# EasyEDA Pro project ProPrj_elrsTransmitter_2026-04-23.epro

# Schematic Schematic2
Board Name: PCB2; Create Date: 2026-03-08; Page Name: P1; Project Name: elrsTransmitter; Schematic Name: Schematic2; Update Date: 2026-03-09; Company: EasyEDA.com; Page Size: A4; Version: V1.0
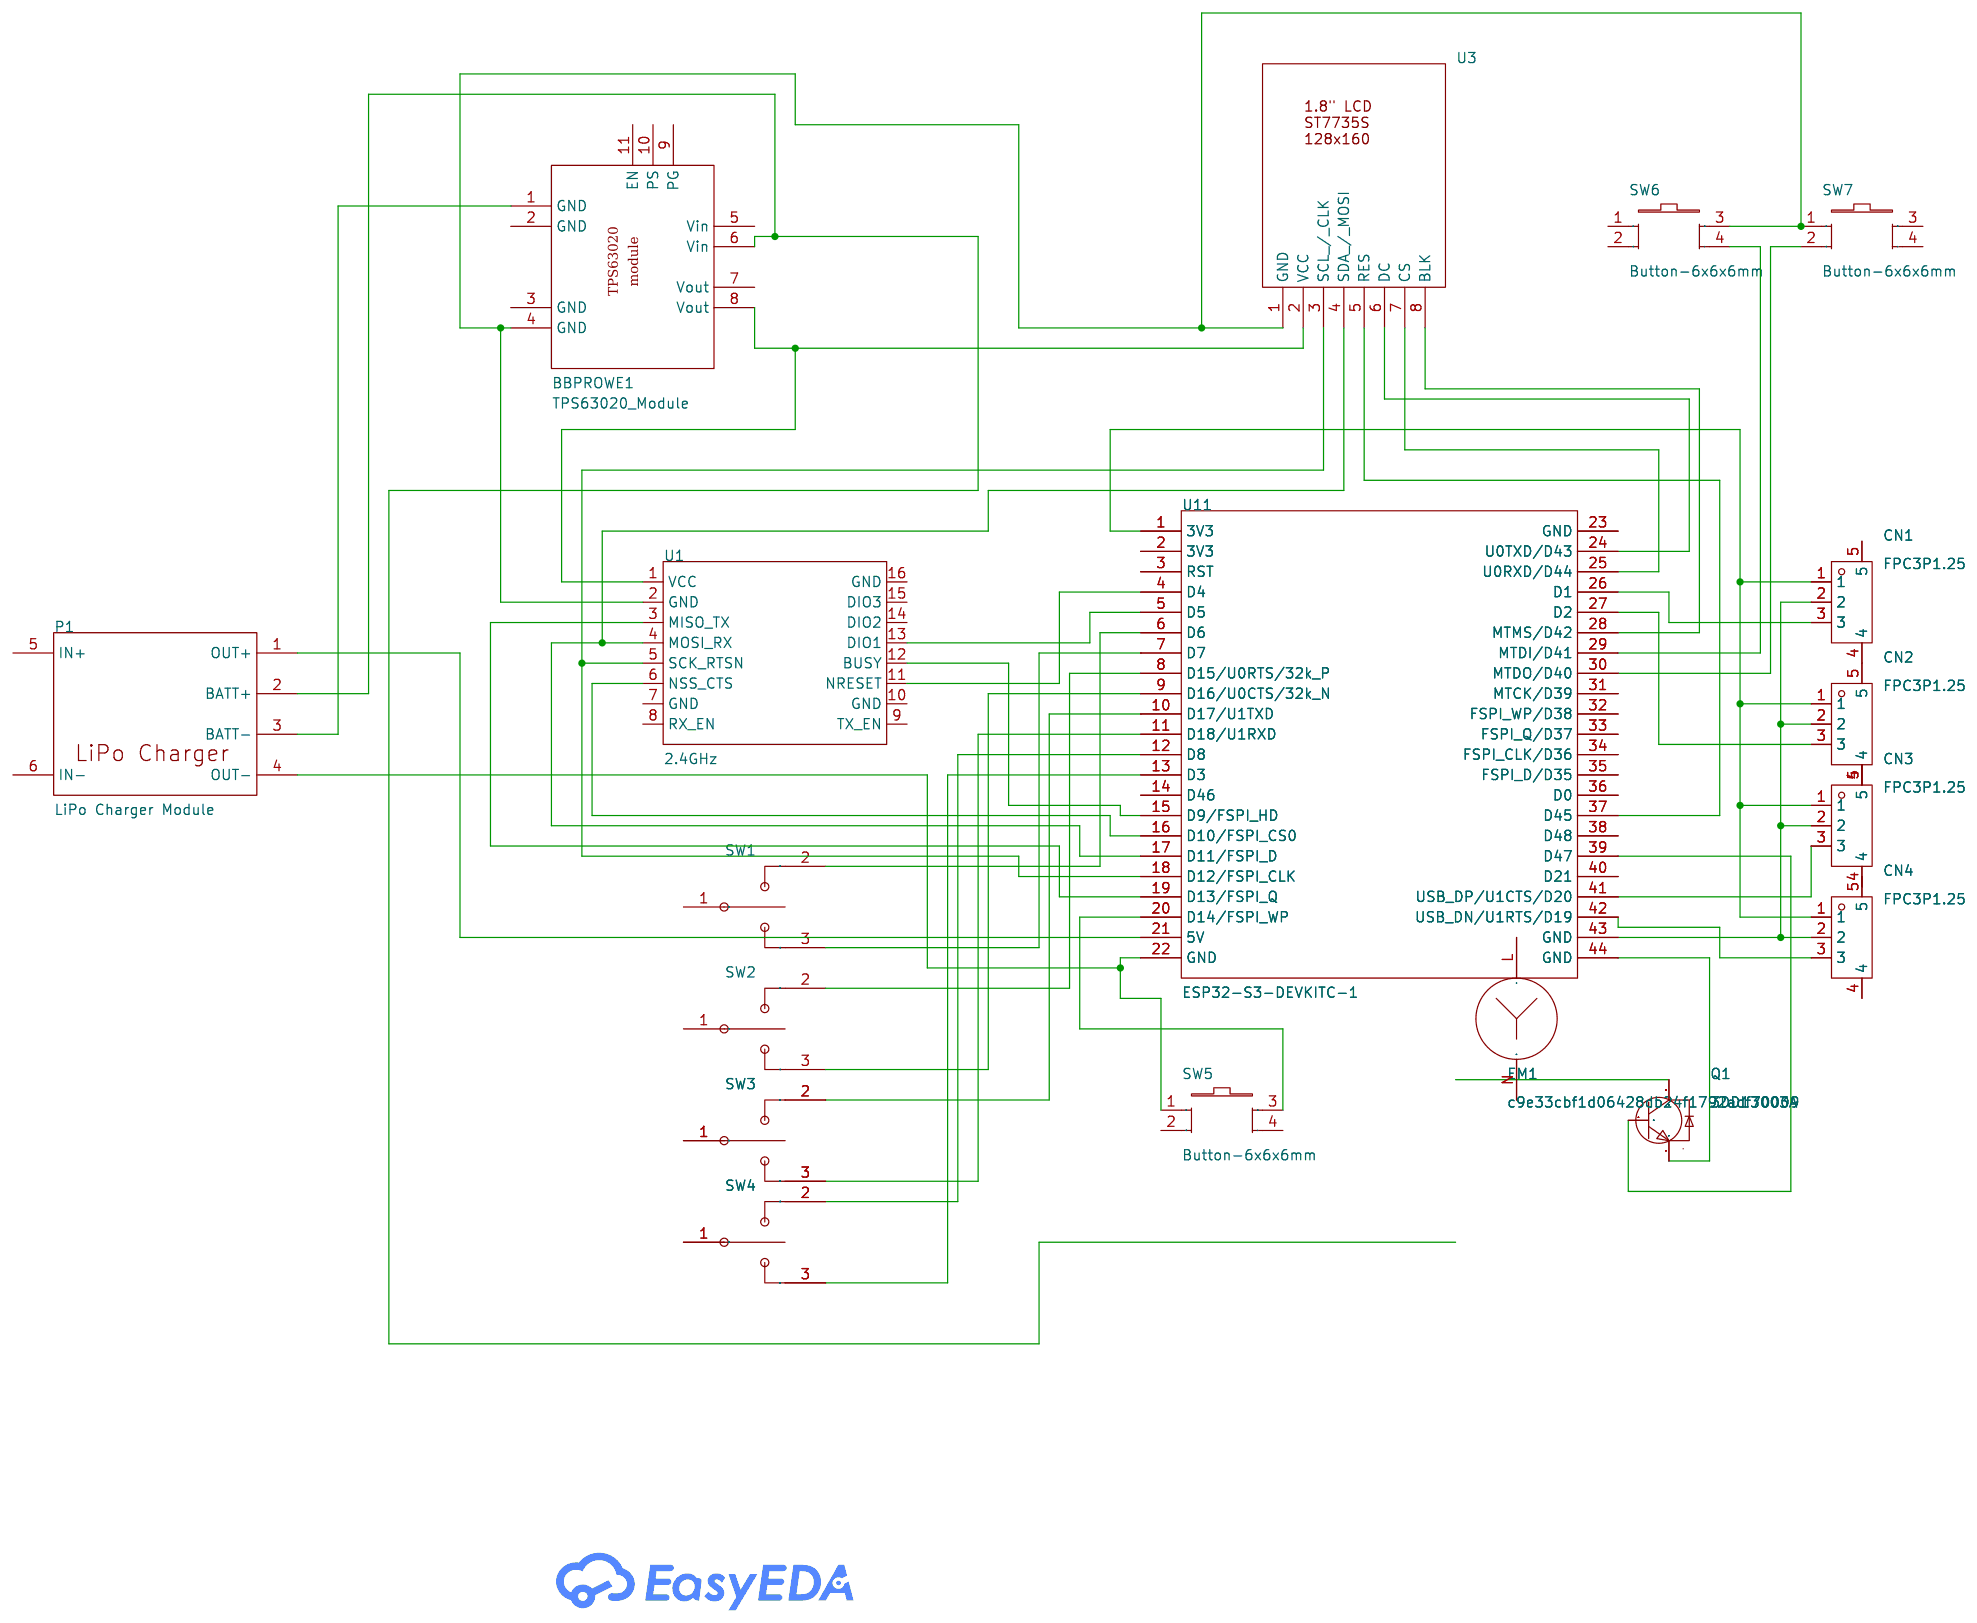
[diagram p0: schematic sheet]

## Parts
BBPROWE1  TPS63020_Module  [TPS63020_MODULE_PCB]
CN1  FPC3P1.25  [CONN-SMD_3P-P1.25_1.25T-3PWT]
CN2  FPC3P1.25  [CONN-SMD_3P-P1.25_1.25T-3PWT]
CN3  FPC3P1.25  [CONN-SMD_3P-P1.25_1.25T-3PWT]
CN4  FPC3P1.25  [CONN-SMD_3P-P1.25_1.25T-3PWT]
EM1  c9e33cbf1d06428db24f1792adf70009  [CONN-TH_2P-P2.54-V]
P1  LiPo Charger Module  [LIPO CHARGER FOOTPRINT]
Q1  3DD13003A  [TO-92-3_L4.8-W3.7-P1.27-L]
SW1  -  [3_Pin_Toggle_Switch_Footprint]
SW2  -  [3_Pin_Toggle_Switch_Footprint]
SW3  -  [3_Pin_Toggle_Switch_Footprint]
SW4  -  [3_Pin_Toggle_Switch_Footprint]
SW5  Button-6x6x6mm  [SW-TH_4PIN-L6.00-W6.00]
SW6  Button-6x6x6mm  [SW-TH_4PIN-L6.00-W6.00]
SW7  Button-6x6x6mm  [SW-TH_4PIN-L6.00-W6.00]
U1  2.4GHz  [WIRELM-SMD_E28-2G4M27SX]
U3  -  [WeAct 1.8 inch TFT ST7735S]
U11  ESP32-S3-DEVKITC-1  [ESP32-S3-DEVKITC-1]

## Library data of the parts
BBPROWE1 = TPS63020_Module
CN1-CN4 = FPC3P1.25: Supplier Part: C9900020598; Supplier Footprint: JST-SH3-pin1.25mm; JLCPCB Part Class: Extended Part; Supplier: LCSC
EM1 = GVI AC Fan: GVI AC Fan for half size server rack; Manufacturer: GVI
P1 = LiPo Charger Module
Q1 = 3DD13003A: Current - Collector(Ic):1.5A Collector - Emitter Voltage VCEO:450V Pd - Power Dissipation:40W Transition frequency(fT):4MHz Current - Collector Cutoff:100uA Vce Saturation(VCE(sat)):2V@1.5A,0.5A; LCSC Part Name: MOSFET管; Supplier Part: C5148290; Manufacturer: 吉林华微; Supplier Footprint: TO-92-FJ; JLCPCB Part Class: Extended Part; Datasheet: https://item.szlcsc.com/datasheet/3DD13003A/5771105.html; Supplier: LCSC; Current - Collector(Ic): 1.5A; Collector - Emitter Voltage VCEO: 450V; Pd - Power Dissipation: 40W; Transition frequency(fT): 4MHz; Current - Collector Cutoff: 100uA; Vce Saturation(VCE(sat)): 2V@1.5A,0.5A
SW1-SW4 = 3_Position_Toggle_Switch
SW5-SW7 = Button-6x6x6mm: Supplier Part: C71836; Supplier: LCSC; Manufacturer: BBJ; Manufacturer Part: Switch,6*6*6Plastic head,260G, 0.25mm,Straight line
U1 = E28-2G4M27SX: Frequency:2.4GHz; LCSC Part Name: 2.4G LORA扩频 SX1280spi模组 测距定位RSSI; Supplier Part: C5333988; Manufacturer: EBYTE(亿佰特); Supplier Footprint: SMD,20x16mm; JLCPCB Part Class: Extended Part; Datasheet: https://item.szlcsc.com/datasheet/E28-2G4M27SX/6097540.html; Supplier: LCSC
U3 = WeAct 1.8inch TFT Display ST7735
U11 = ESP32-S3-DEVKITC-1: Manufacturer: Espressif; Manufacturer Part: ESP32-S3-DEVKITC-1U-N8R8; Supplier: DigiKey; Supplier Part: 1965-ESP32-S3-DEVKITC-1U-N8R8-ND; _: 3

## Nets
$1N4301: U1.3(MISO_TX) U11.19(D13/FSPI_Q)
$1N4309: U1.4(MOSI_RX) U3.4(SDA / MOSI) U11.17(D11/FSPI_D)
$1N4318: U1.5(SCK_RTSN) U3.3(SCL / CLK) U11.18(D12/FSPI_CLK)
$1N4332: U1.6(NSS_CTS) U11.16(D10/FSPI_CS0)
$1N4348: U1.12(BUSY) U11.15(D9/FSPI_HD)
$1N4366: U1.11(NRESET) U11.4(D4)
$1N4372: U1.13(DIO1) U11.5(D5)
$1N4381: P1.4(OUT-) SW5.1 U11.22(GND)
$1N4388: SW5.3 U11.20(D14/FSPI_WP)
$1N4396: SW1.2 U11.6(D6)
$1N4423: SW1.3 U11.7(D7)
$1N4459: SW2.2 U11.8(D15/U0RTS/32k_P)
$1N4469: SW2.3 U11.9(D16/U0CTS/32k_N)
$1N4476: SW3.2 U11.10(D17/U1TXD)
$1N4500: SW3.3 U11.11(D18/U1RXD)
$1N4506: SW4.2 U11.12(D8)
$1N4513: SW4.3 U11.13(D3)
$1N4524: Q1.1(E) U11.44(GND)
$1N4531: Q1.3(B) U11.39(D47)
$1N4600: BBPROWE1.4(GND) SW6.3 SW7.1 U1.2(GND) U3.1(GND)
$1N4614: BBPROWE1.8(Vout) U1.1(VCC) U3.2(VCC)
$1N4692: U3.5(RES) U11.37(D45)
$1N4718: U3.6(DC) U11.24(U0TXD/D43)
$1N4728: U3.7(CS) U11.25(U0RXD/D44)
$1N4736: U3.8(BLK) U11.28(MTMS/D42)
$1N4744: CN1.2 CN2.2 CN3.2 CN4.2 U11.43(GND)
$1N4790: CN1.1 CN2.1 CN3.1 CN4.1 U11.1(3V3)
$1N4847: CN1.3 U11.26(D1)
$1N4854: CN2.3 U11.27(D2)
$1N4861: CN3.3 U11.41(USB_DP/U1CTS/D20)
$1N4867: CN4.3 U11.42(USB_DN/U1RTS/D19)
$1N4955: SW6.4 U11.29(MTDI/D41)
$1N4963: SW7.2 U11.30(MTDO/D40)
$1N5146: BBPROWE1.1(GND) P1.3(BATT-)
$1N5213: P1.1(OUT+) U11.21(5V)
$1N5421: CN1.4 CN2.5
Net-(BBPROWE1-6): BBPROWE1.6(Vin) P1.2(BATT+)

Not connected (* = marked no-connect by the designer): BBPROWE1 2(GND) 3(GND) 5(Vin) 7(Vout) 9(PG) 10(PS) 11(EN); CN1 5; CN2 4; CN3 4 5; CN4 4 5; EM1 L N; P1 5(IN+) 6(IN-); Q1 2(C); SW1 1; SW2 1; SW3 1; SW4 1; SW5 2 4; SW6 1 2; SW7 3 4; U1 7(GND) 8(RX_EN) 9(TX_EN) 10(GND) 14(DIO2) 15(DIO3) 16(GND); U11 2(3V3) 3(RST) 14(D46) 23(GND) 31(MTCK/D39) 32(FSPI_WP/D38) 33(FSPI_Q/D37) 34(FSPI_CLK/D36) 35(FSPI_D/D35) 36(D0) 38(D48) 40(D21)

# Board PCB2
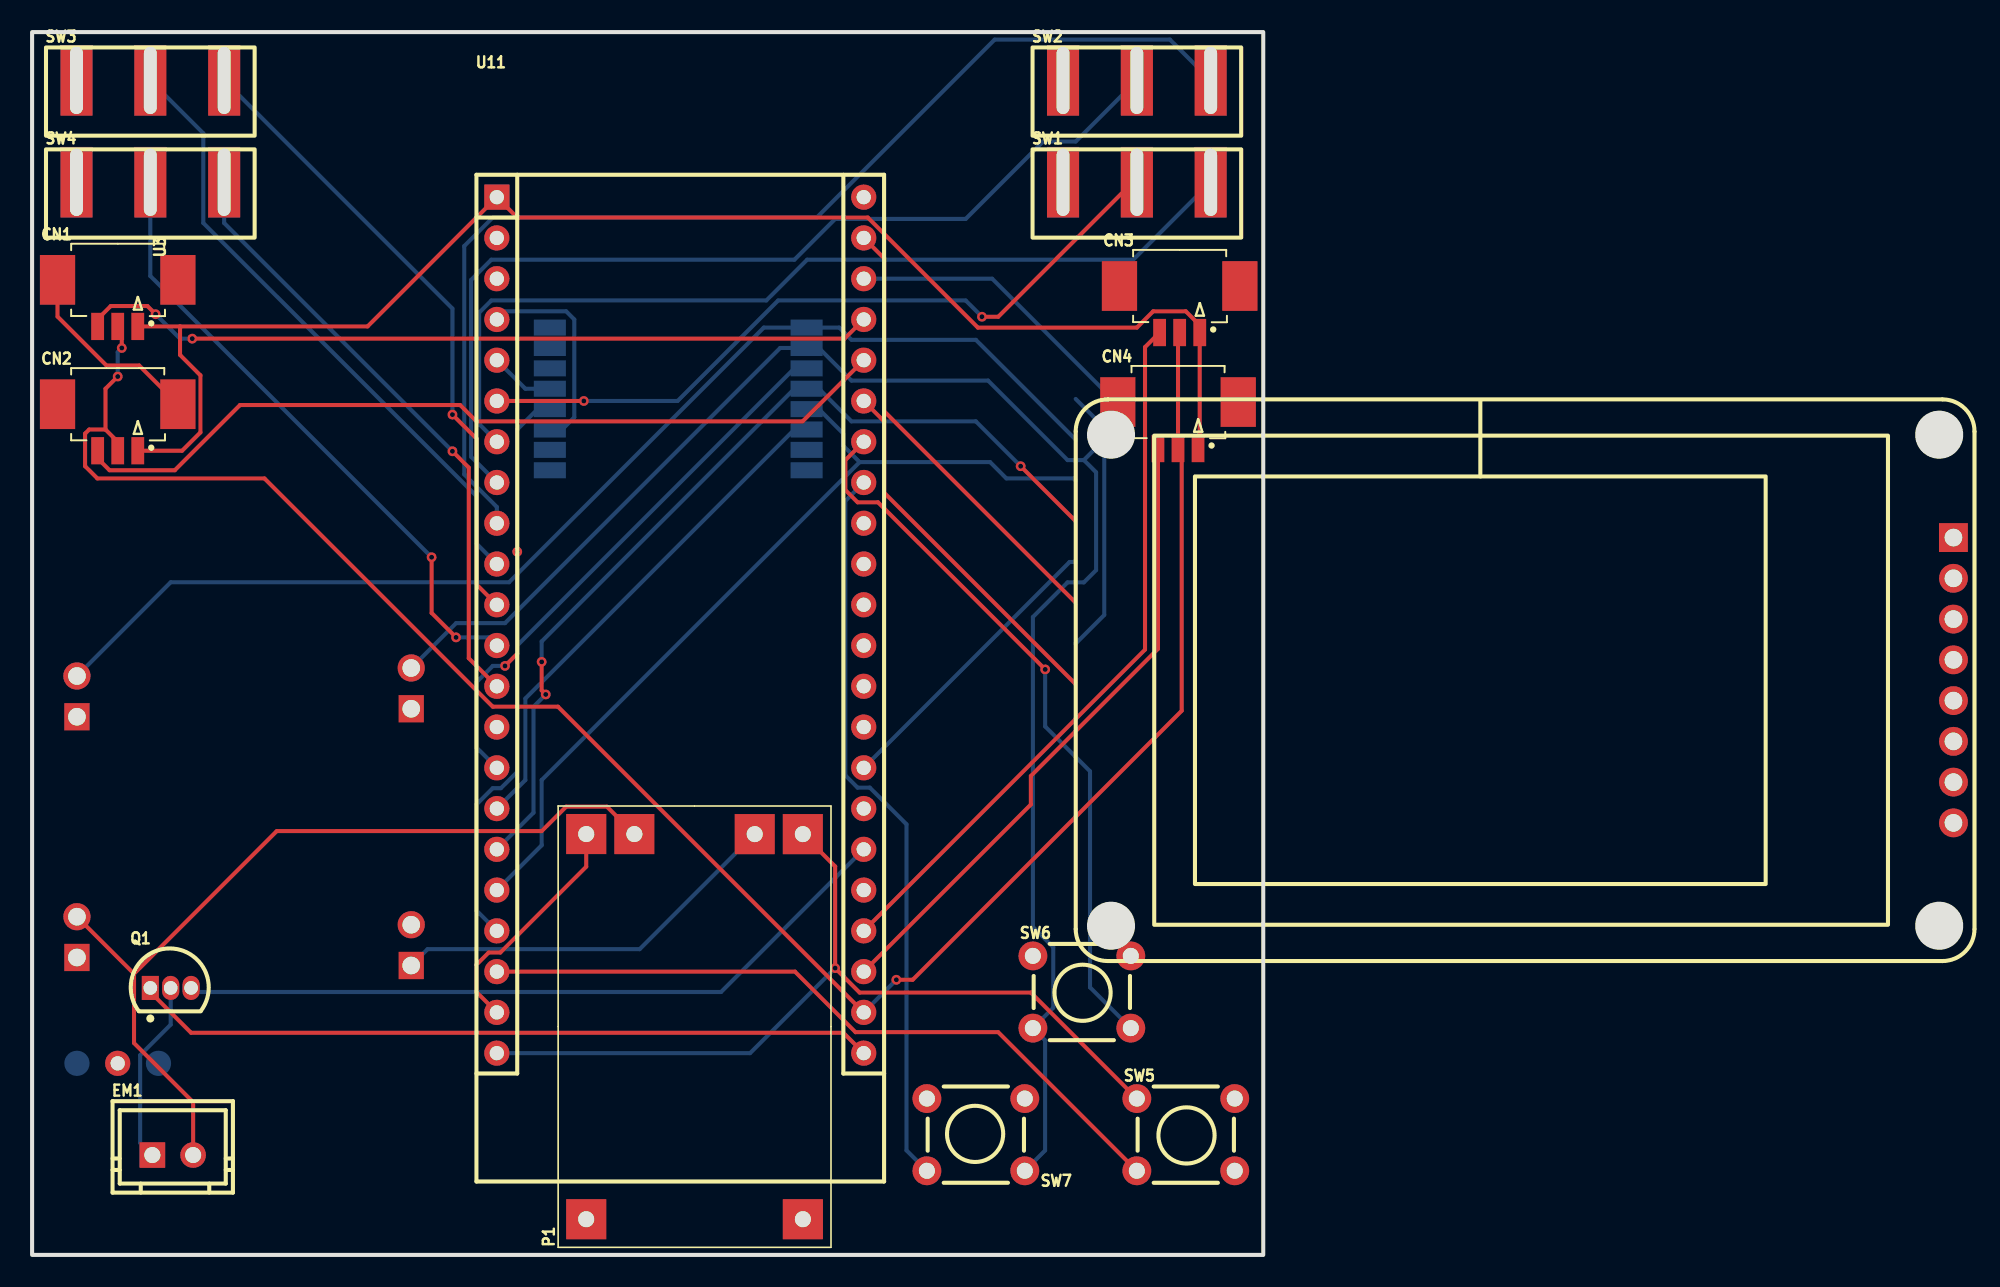
[diagram p1: board, top side]
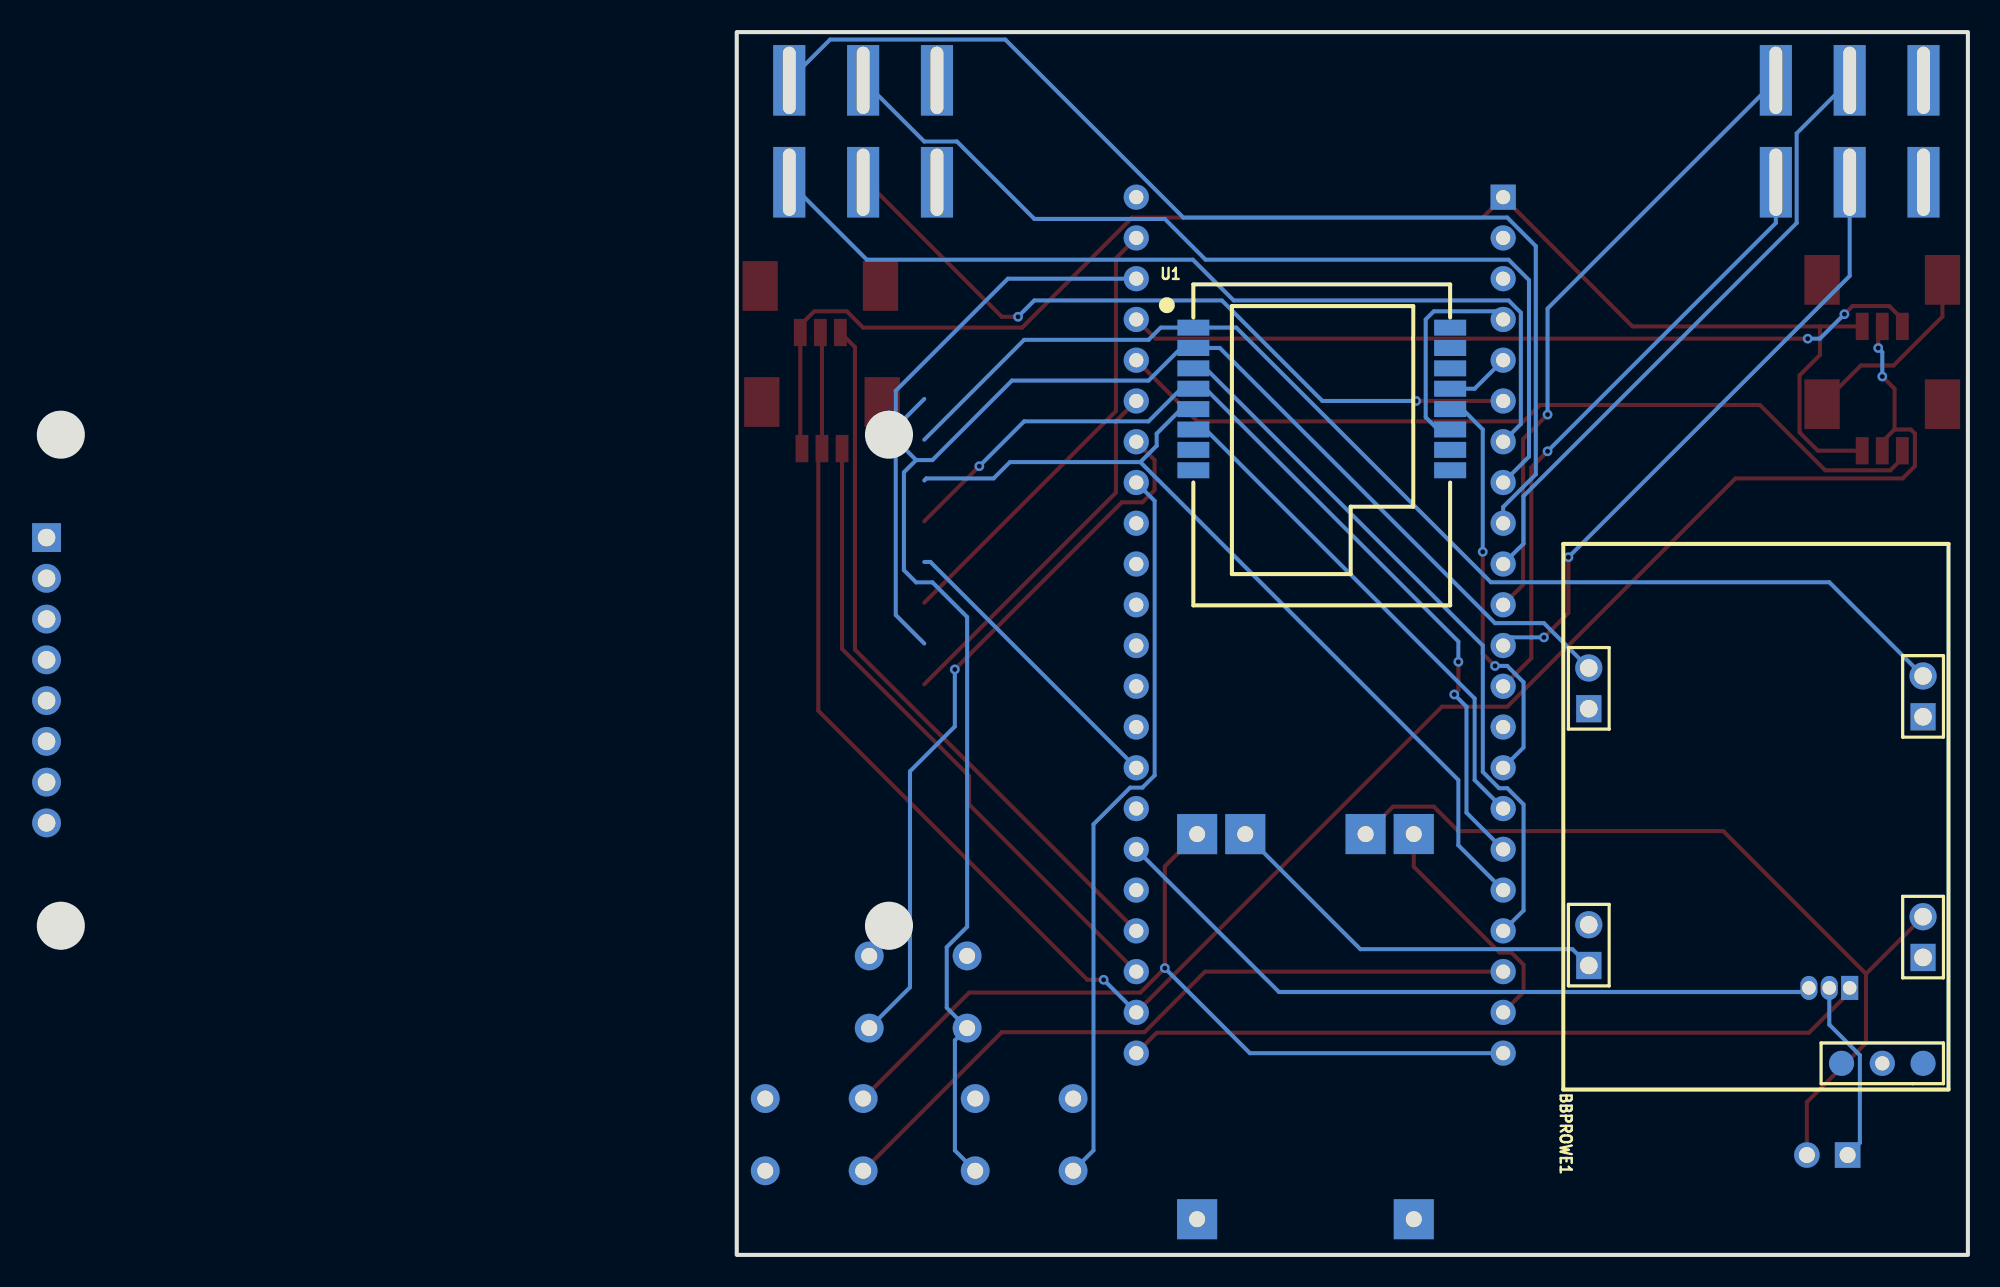
[diagram p2: board, bottom side, seen from below]

Outline 120.32 x 76.2 mm; copper layers: Top Layer, Bottom Layer. Coordinates in mm from the lower left corner of the outline.
Outline path: rectangle 0,76.2 76.71,0
Stack: Top Layer 0.035mm / Dielectric1 1.51mm FR4 er 4.5 / Bottom Layer 0.035mm

## Design rules (mm)
template: JLCPCB Capability(Two Layers Board)
spacing copperThickness1oz (default): track to track 0.102, other pairs 0.152 to 0.3
spacing copperThickness2oz: track to track 0.203, other pairs 0.152 to 0.3
track width copperThickness1oz (default): min 0.127, default 0.254, max 2.54
track width copperThickness2oz: min 0.203, default 0.254, max 2.54
differential pair differentialPair (default): width min 0.127, default 0.254, max 2.54; gap min 0.152, default 0.152
via viaSize (default): diameter min 0.5, default 0.61, max 10; hole min 0.3, default 0.305, max 6.3

## Placement (name value [footprint] x y rotation side)
BBPROWE1  TPS63020_Module  [TPS63020_MODULE_PCB]  13.21 27.3 90 bottom
CN1  FPC3P1.25  [CONN-SMD_3P-P1.25_1.25T-3PWT]  5.33 59.31 0 top
CN2  FPC3P1.25  [CONN-SMD_3P-P1.25_1.25T-3PWT]  5.33 51.56 0 top
CN3  FPC3P1.25  [CONN-SMD_3P-P1.25_1.25T-3PWT]  71.5 58.93 0 top
CN4  FPC3P1.25  [CONN-SMD_3P-P1.25_1.25T-3PWT]  71.4 51.7 0 top
EM1  c9e33cbf1d06428db24f1792adf70009  [CONN-TH_2P-P2.54-V]  8.76 6.22 0 top
P1  LiPo Charger Module  [LIPO CHARGER FOOTPRINT]  41.27 14.22 90 top
Q1  3DD13003A  [TO-92-3_L4.8-W3.7-P1.27-L]  8.64 16.64 0 top
SW1  -  [3_Pin_Toggle_Switch_Footprint]  68.83 64.64 0 top
SW2  -  [3_Pin_Toggle_Switch_Footprint]  68.83 70.99 0 top
SW3  -  [3_Pin_Toggle_Switch_Footprint]  7.37 70.99 0 top
SW4  -  [3_Pin_Toggle_Switch_Footprint]  7.37 64.64 0 top
SW5  Button-6x6x6mm  [SW-TH_4PIN-L6.00-W6.00]  71.88 7.49 0 top
SW6  Button-6x6x6mm  [SW-TH_4PIN-L6.00-W6.00]  65.41 16.38 0 top
SW7  Button-6x6x6mm  [SW-TH_4PIN-L6.00-W6.00]  58.8 7.49 180 top
U1  2.4GHz  [WIRELM-SMD_E28-2G4M27SX]  40.26 53.34 180 bottom
U3  -  [WeAct 1.8 inch TFT ST7735S]  65.02 53.34 270 top
U11  -  [ESP32-S3-DEVKITC-1]  40.39 35.43 0 top

## Footprints (pads in the part's own frame, mm; a bottom-side part is the same pattern mirrored in y, then rotated)
3_Pin_Toggle_Switch_Footprint
  rect 2x4.4 hole 0.8x4.2: 1(-4.6,2.2) 2(0,2.2) 3(4.6,2.2)
CONN-SMD_3P-P1.25_1.25T-3PWT
  rect 0.8x1.7 smd: 1(1.25,-1.45) 2(0,-1.45) 3(-1.25,-1.45)
  rect 2.2x3.1 smd: 4(-3.75,1.45) 5(3.75,1.45)
CONN-TH_2P-P2.54-V
  rect 1.6x1.6 hole 1: L(-1.27,0)
  round 1.6 hole 1: N(1.27,0)
ESP32-S3-DEVKITC-1
  rect 1.575x1.575 hole 0.889: 1(-11.43,30.48)
  round 1.575 hole 0.889: 2(-11.43,27.94) 3(-11.43,25.4) 4(-11.43,22.86) 5(-11.43,20.32) 6(-11.43,17.78) 7(-11.43,15.24) 8(-11.43,12.7) 9(-11.43,10.16) 10(-11.43,7.62) 11(-11.43,5.08) 12(-11.43,2.54) 13(-11.43,0) 14(-11.43,-2.54) 15(-11.43,-5.08) 16(-11.43,-7.62) 17(-11.43,-10.16) 18(-11.43,-12.7) 19(-11.43,-15.24) 20(-11.43,-17.78) 21(-11.43,-20.32) 22(-11.43,-22.86) 23(11.43,30.48) 24(11.43,27.94) 25(11.43,25.4) 26(11.43,22.86) 27(11.43,20.32) 28(11.43,17.78) 29(11.43,15.24) 30(11.43,12.7) 31(11.43,10.16) 32(11.43,7.62) 33(11.43,5.08) 34(11.43,2.54) 35(11.43,0) 36(11.43,-2.54) 37(11.43,-5.08) 38(11.43,-7.62) 39(11.43,-10.16) 40(11.43,-12.7) 41(11.43,-15.24) 42(11.43,-17.78) 43(11.43,-20.32) 44(11.43,-22.86)
LIPO CHARGER FOOTPRINT
  rect 2.5x2.5 hole 1: 1(12.002,6.748) 2(12,3.75) 3(11.998,-3.748) 4(11.998,-6.747) 5(-12,6.75) 6(-12,-6.75)
SW-TH_4PIN-L6.00-W6.00
  round 1.8 hole 1: 1(-3.05,2.25) 2(3.05,2.25) 3(-3.05,-2.25) 4(3.05,-2.25)
TO-92-3_L4.8-W3.7-P1.27-L
  rect 1.07x1.5 hole 0.85: 1(-1.27,0)
  oval 1.07x1.5 hole 0.85: 2(0,0) 3(1.27,0)
TPS63020_MODULE_PCB
  rect 1.7x1.575 hole 1.1: 1(-9.27,10.414) 3(6.73,10.414) 5(-8.77,-10.414) 7(6.23,-10.414)
  round 1.7 hole 1.1: 2(-6.73,10.414) 4(9.27,10.414) 6(-6.23,-10.414) 8(8.77,-10.414)
  round 1.575 smd: 9(-15.367,-10.414) 11(-15.367,-5.334)
  round 1.575 hole 0.889: 10(-15.367,-7.874)
WeAct 1.8 inch TFT ST7735S
  rect 1.8x1.8 hole 1.1: 1(8.638,54.689)
  round 1.8 hole 1.1: 2(11.178,54.689) 3(13.718,54.689) 4(16.258,54.689) 5(18.798,54.689) 6(21.338,54.689) 7(23.878,54.689) 8(26.418,54.689)
WIRELM-SMD_E28-2G4M27SX
  rect 2x1 smd: 1(-8,4.445) 2(-8,3.175) 3(-8,1.905) 4(-8,0.635) 5(-8,-0.635) 6(-8,-1.905) 7(-8,-3.175) 8(-8,-4.445) 9(8,-4.445) 10(8,-3.175) 11(8,-1.905) 12(8,-0.635) 13(8,0.635) 14(8,1.905) 15(8,3.175) 16(8,4.445)

## Nets
As in the schematic, except:
$1N4520: EM1.L Q1.2
$1N4539: BBPROWE1.6 EM1.N P1.2

Pads without a net: BBPROWE1 2 3 5 7 9 10 11; CN1 5; CN2 4; CN3 4 5; CN4 4 5; P1 5 6; SW1 1; SW2 1; SW3 1; SW4 1; SW5 2 4; SW6 1 2; SW7 3 4; U1 7 8 9 10 14 15 16; U11 2 3 14 23 31 32 33 34 35 36 38 40

## Via types
v1: diameter 0.61, hole 0.305, Top Layer to Bottom Layer, 18 vias

## Routing (per net, layer and track width the routed paths; a pad name or vN(x,y) marks a point on that pad's centre or on a via; arc(x,y) is an arc through that point)
$1N4301: length 44.8
  Bottom Layer w0.254: U11.19 27.69,21.46 27.69,28.07 28.7,29.08 29.21,29.08 30.22,30.1 30.22,37.97 47.5,55.25 U1.3
$1N4309: length 57.5
  Top Layer w0.254: v1(32,34.92) 31.75,35.18 v1(31.75,36.96) ; v1(61.6,49.15) 65.02,45.72
  Bottom Layer w0.254: v1(31.75,36.96) 31.75,38.23 47.5,53.97 U1.4 49.02,53.97 51.05,51.94 58.8,51.94 v1(61.6,49.15) ; U11.17 31.24,27.56 31.24,34.16 v1(32,34.92)
$1N4318: length 55.1
  Bottom Layer w0.254: 51.56,49.4 50.55,50.42 50.55,51.18 49.02,52.7 U1.5 ; 51.56,49.4 31.75,29.59 31.75,25.53 U11.18 ; 51.56,49.4 59.69,49.4 60.7,48.39 64.9,48.39 65.02,48.26
$1N4332: length 32.1
  Bottom Layer w0.254: U1.6 47.5,51.44 30.73,34.67 30.73,29.59 U11.16
$1N4348: length 25.7
  Top Layer w0.254: v1(30.23,43.81) 30.23,37.47 v1(29.47,36.7)
  Bottom Layer w0.254: U11.15 27.69,31.62 27.69,35.69 28.7,36.7 v1(29.47,36.7) ; v1(30.23,43.81) 30.23,51.44 31.5,52.7 U1.12
$1N4366: length 13.2
  Bottom Layer w0.254: U1.11 33.02,51.44 33.78,52.2 33.78,58.29 33.28,58.8 29.46,58.8 U11.4
$1N4372: length 4
  Bottom Layer w0.254: U11.5 30.73,53.97 U1.13
$1N4381: length 54.6
  Top Layer w0.254: SW5.1 62.23,16.35 51.56,16.35 v1(50.04,17.87) 50.04,24.21 P1.4
  Bottom Layer w0.254: U11.22 44.74,12.57 v1(50.04,17.87)
$1N4388: length 45
  Top Layer w0.254: SW5.3 60.2,13.88 51.31,13.88 47.53,17.65 U11.20
$1N4396: length 46.4
  Top Layer w0.254: v1(59.18,58.46) 60.2,58.46 68.58,66.84 SW1.2 ; v1(34.38,53.21) U11.6
  Bottom Layer w0.254: v1(34.38,53.21) 40.22,53.21 46.48,59.48 58.17,59.48 v1(59.18,58.46)
$1N4423: length 57.4
  Bottom Layer w0.254: U11.7 27.85,51.78 27.85,58.72 28.62,59.48 45.75,59.48 48.29,62.02 68.61,62.02 SW1.3
$1N4459: length 59.9
  Bottom Layer w0.254: U11.8 27.35,49.74 27.35,60.75 28.62,62.02 47.5,62.02 50.04,64.56 58.17,64.56 62.99,69.38 65.02,69.38 SW2.2
$1N4469: length 71
  Bottom Layer w0.254: SW2.3 70.89,75.73 59.97,75.73 48.88,64.64 28.7,64.64 26.92,62.86 26.92,48.64 28.96,46.61 U11.9
$1N4476: length 39.1
  Bottom Layer w0.254: SW3.2 10.67,69.89 10.67,64.3 27.69,47.28 27.69,44.32 U11.10
$1N4500: length 39.7
  Top Layer w0.254: U11.11 27.71,41.75 27.71,50.84 v1(26.19,52.36)
  Bottom Layer w0.254: SW3.3 26.19,58.97 v1(26.19,52.36)
$1N4506: length 39
  Top Layer w0.254: v1(26.42,38.48) 24.89,40 v1(24.89,43.47)
  Bottom Layer w0.254: v1(24.89,43.47) 7.37,61 SW4.2 ; v1(26.42,38.48) 28.45,38.48 U11.12
$1N4513: length 38.4
  Top Layer w0.254: U11.13 27.21,37.18 27.21,49.06 v1(26.19,50.08)
  Bottom Layer w0.254: v1(26.19,50.08) 11.97,64.3 SW4.3
$1N4520: length 11.5
  Bottom Layer w0.254: Q1.2 8.64,14.35 6.73,12.45 6.73,6.98 7.49,6.22
$1N4524: length 46.3
  Top Layer w0.254: U11.44 50.55,13.84 9.91,13.84 7.37,16.38 Q1.1
$1N4531: length 45.7
  Bottom Layer w0.254: Q1.3 10.16,16.38 42.93,16.38 U11.39
$1N4539: length 54
  Top Layer w0.254: 37.53,26.22 35.82,27.93 33.27,27.93 31.75,26.41 15.24,26.41 6.35,17.52 ; 6.35,17.52 BBPROWE1.6 ; 6.35,17.52 6.35,13.2 10.03,9.52 EM1.N
$1N4600: length 106.4
  Bottom Layer w0.254: SW7.1 63.12,6.51 63.12,13.37 SW6.3 63.63,15.4 63.63,19.17 62.36,20.44 62.36,39.75 64.52,41.91 65.53,41.91 66.29,42.67 66.29,48.77 65.53,49.53 ; 65.02,53.34 66.29,52.07 66.29,50.29 65.53,49.53 ; BBPROWE1.4 26.42,39.37 29.46,39.37 46.61,56.52 U1.2 49.02,56.52 51.05,54.48 59.56,54.48 64.52,49.53 65.53,49.53
$1N4614: length 74.1
  Bottom Layer w0.254: 65.02,50.8 58.8,57.02 51.05,57.02 50.29,57.78 U1.1 45.59,57.78 29.72,41.92 8.64,41.92 BBPROWE1.8
$1N4692: length 18.5
  Bottom Layer w0.254: 65.02,43.18 64.64,43.18 U11.37
$1N4718: length 28.2
  Top Layer w0.254: U11.24 53.09,62.1 53.09,52.58 65.02,40.64
$1N4728: length 34.4
  Bottom Layer w0.254: U11.25 59.82,60.83 66.8,53.85 66.8,39.88 65.02,38.1
$1N4736: length 23.1
  Top Layer w0.254: U11.28 53.09,51.94 53.09,47.5 65.02,35.56
$1N4744: length 125.9
  Top Layer w0.254: v1(53.85,17.14) 54.86,17.14 71.63,33.91 71.63,50.02 CN4.2 71.4,57.38 CN3.2 ; 4.57,51.44 3.56,51.44 3.3,51.18 3.3,49.15 4.06,48.39 14.48,48.39 28.7,34.16 32.77,34.16 U11.43 ; 4.57,51.44 5.33,50.67 CN2.2 ; 4.57,51.44 4.57,53.97 v1(5.33,54.74) ; v1(5.59,56.52) 5.59,57.61 CN1.2
  Bottom Layer w0.254: U11.43 v1(53.85,17.14) ; v1(5.33,54.74) 5.33,56.26 v1(5.59,56.52)
$1N4790: length 92.9
  Top Layer w0.254: 9.22,57.86 20.9,57.86 U11.1 30.23,64.64 52.07,64.64 58.93,57.78 68.83,57.78 69.85,58.8 71.88,58.8 72.75,57.93 CN3.1 72.75,50.35 CN4.1 ; 9.22,57.86 CN1.1 ; 9.22,57.86 9.22,56.08 10.49,54.81 10.49,51.25 9.34,50.11 CN2.1
$1N4847: length 49.9
  Top Layer w0.254: U11.26 50.62,57.1 v1(9.98,57.1) ; CN1.3 4.08,58.31 4.9,59.13 7.19,59.13 v1(7.69,58.62)
  Bottom Layer w0.254: v1(9.98,57.1) 9.22,57.1 v1(7.69,58.62)
$1N4854: length 52.2
  Top Layer w0.254: U11.27 48.01,51.94 27.69,51.94 26.67,52.96 12.95,52.96 8.89,48.89 4.83,48.89 4.08,49.64 CN2.3
$1N4861: length 44.9
  Top Layer w0.254: CN3.3 69.34,56.57 69.34,37.72 U11.41
$1N4867: length 40.2
  Top Layer w0.254: U11.42 62.23,28.07 62.23,29.84 70.15,37.76 CN4.3
$1N4955: length 45.1
  Top Layer w0.254: U11.29 50.67,49.53 50.67,47.66 51.44,46.9 52.71,46.9 v1(63.12,36.48)
  Bottom Layer w0.254: v1(63.12,36.48) 63.12,32.93 65.92,30.14 65.92,16.67 SW6.4
$1N4963: length 45.9
  Bottom Layer w0.254: U11.30 50.67,46.99 50.67,29.88 51.43,29.12 52.2,29.12 54.48,26.83 54.48,6.51 SW7.2
$1N5146: length 24.8
  Bottom Layer w0.254: P1.3 37.85,19.05 24.64,19.05 BBPROWE1.1
$1N5213: length 14.9
  Top Layer w0.254: P1.1 34.53,24.19 29.17,18.84 28.45,18.84 27.69,18.08 27.69,16.38 U11.21
$1N5421: length 12
  Top Layer w0.254: CN1.4 1.58,58.47 4.63,55.42 6.67,55.42 CN2.5
